# Altium schematic sheet v1.0.SchDoc
size 177 x 101 mm
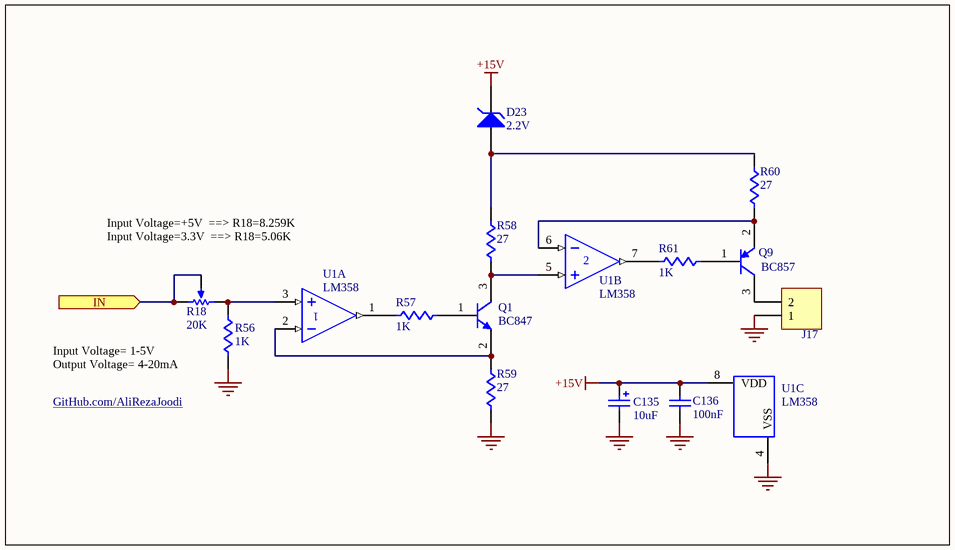
[diagram p0: v1.0.SchDoc]

## Parts
C135  value 10uF  [Cap_B]  (hidden comment: Capacitor)
C136  value 100nF  [0805]  (hidden comment: Cap)
D23  value 2.2V  [MELF-D3516-1406]  (hidden comment: LED)
J17  J17  [Fonics_2PIN_1]  (value not drawn)
Q1  value BC847  [SOT23-3N]  (hidden comment: NPN)
Q9  value BC857  [SOT23-3N]  (hidden comment: Q)
R18  value 20K  [VR4_]  (hidden comment: RES)
R56  value 1K  [0805]  (hidden comment: RES)
R57  value 1K  [0805]  (hidden comment: RES)
R58  value 27  [0805]  (hidden comment: R58)
R59  value 27  [0805]  (hidden comment: R59)
R60  value 27  [0805]  (hidden comment: R60)
R61  value 1K  [0805]  (hidden comment: R61)
U1  LM358  [SOP127P636-8N]  (parts A,B,C of 3)

## Ports
IN (in)

## Nets
+15V: C135.1 C136.2 D23.2(K) U1.8(VDD)
GND: C135.2 C136.1 J17.1 R56.2 R59.1 U1.4(VSS)
IN: R18.2(BOT) R18.3(TAP) ; port IN
NetD23_1: D23.1(A) R58.2 R60.2
NetJ17_2: J17.2 Q9.3(C)
NetQ1_1: Q1.1(B) R57.2
NetQ1_2: Q1.2(E) R59.2 U1.2(IN-)
NetQ1_3: Q1.3(C) R58.1 U1.5(IN+)
NetQ9_1: Q9.1(B) R61.2
NetQ9_2: Q9.2(E) R60.1 U1.6(IN-)
NetR18_1: R18.1(TOP) R56.1 U1.3(IN+)
NetR57_1: R57.1 U1.1(OUT)
NetR61_1: R61.1 U1.7(OUT)

## Notes on the sheet
- Input Voltage=+5V  ==> R18=8.259K
  Input Voltage=3.3V  ==> R18=5.06K
- Input Voltage= 1-5V
  Output Voltage= 4-20mA
- GitHub.com/AliRezaJoodi

## Library data of the parts
C135 = Cap Pol1: Polarized Capacitor (Radial); Manufacturer: Generic Components; Class I: Passive; Published: 8-Jun-2000; Revision: July-2002: Re-released for DXP Platform.; Publisher: Altium Limited; Class II: Capacitor
C136 = Cap: Capacitor; Manufacturer: Generic Components; Class I: Passive; Published: 8-Jun-2000; Revision: July-2002: Re-released for DXP Platform.; Publisher: Altium Limited; Class II: Capacitor
D23 = D Zener: Zener Diode; Manufacturer: Generic Components; Class I: Discrete; Class II: Diode - Zener; Published: 8-Jun-2000; Revision: July-2002: Re-released for DXP Platform.; Publisher: Altium Limited
J17 = Header 2: Header, 2-Pin; LatestRevisionDate: 17-Jul-2002; LatestRevisionNote: Re-released for DXP Platform.; Publisher: Altium Limited
Q1 = BC847: Silicon Bipolar Transistor
Q9 = BC857: Silicon Bipolar Transistor
R18 = RPot1: Potentiometer; Manufacturer: Generic Components; Class I: Passive; Set Position: 0.5; Published: 8-Jun-2000; Revision: July-2002: Re-released for DXP Platform.; Publisher: Altium Limited; Class II: Potentiometer
R56-R61 = Res1: Resistor; Manufacturer: Generic Components; Class I: Passive; Published: 8-Jun-2000; Revision: July-2002: Re-released for DXP Platform.; Publisher: Altium Limited; Class II: Resistor
U1 = LM358: Dual Low-Power Operational Amplifier; Published: 17-Jul-2002; LatestRevisionDate: 13-Apr-2006; LatestRevisionNote: IPC-7351 Footprint Added.; DatasheetVersion: 1988; PackageReference: 751-02; Publisher: Altium Limited; PackageDescription: 8-Pin Small Outline Integrated Circuit 1.27 mm Pitch; Code_JEDEC: MS-012-AA; Code_IPC: SOIC127P600-8; ComponentLink1Description: Manufacturer Link; ComponentLink1URL: http://www.onsemi.com/site/products/parametrics/0,4446,251,00.html; ComponentLink2Description: Datasheet; ComponentLink2URL: http://www.onsemi.com/pub/Collateral/LM358-D.PDF